# EAGLE design Goethe_RFID_v2 (EAGLE 7.7.0)
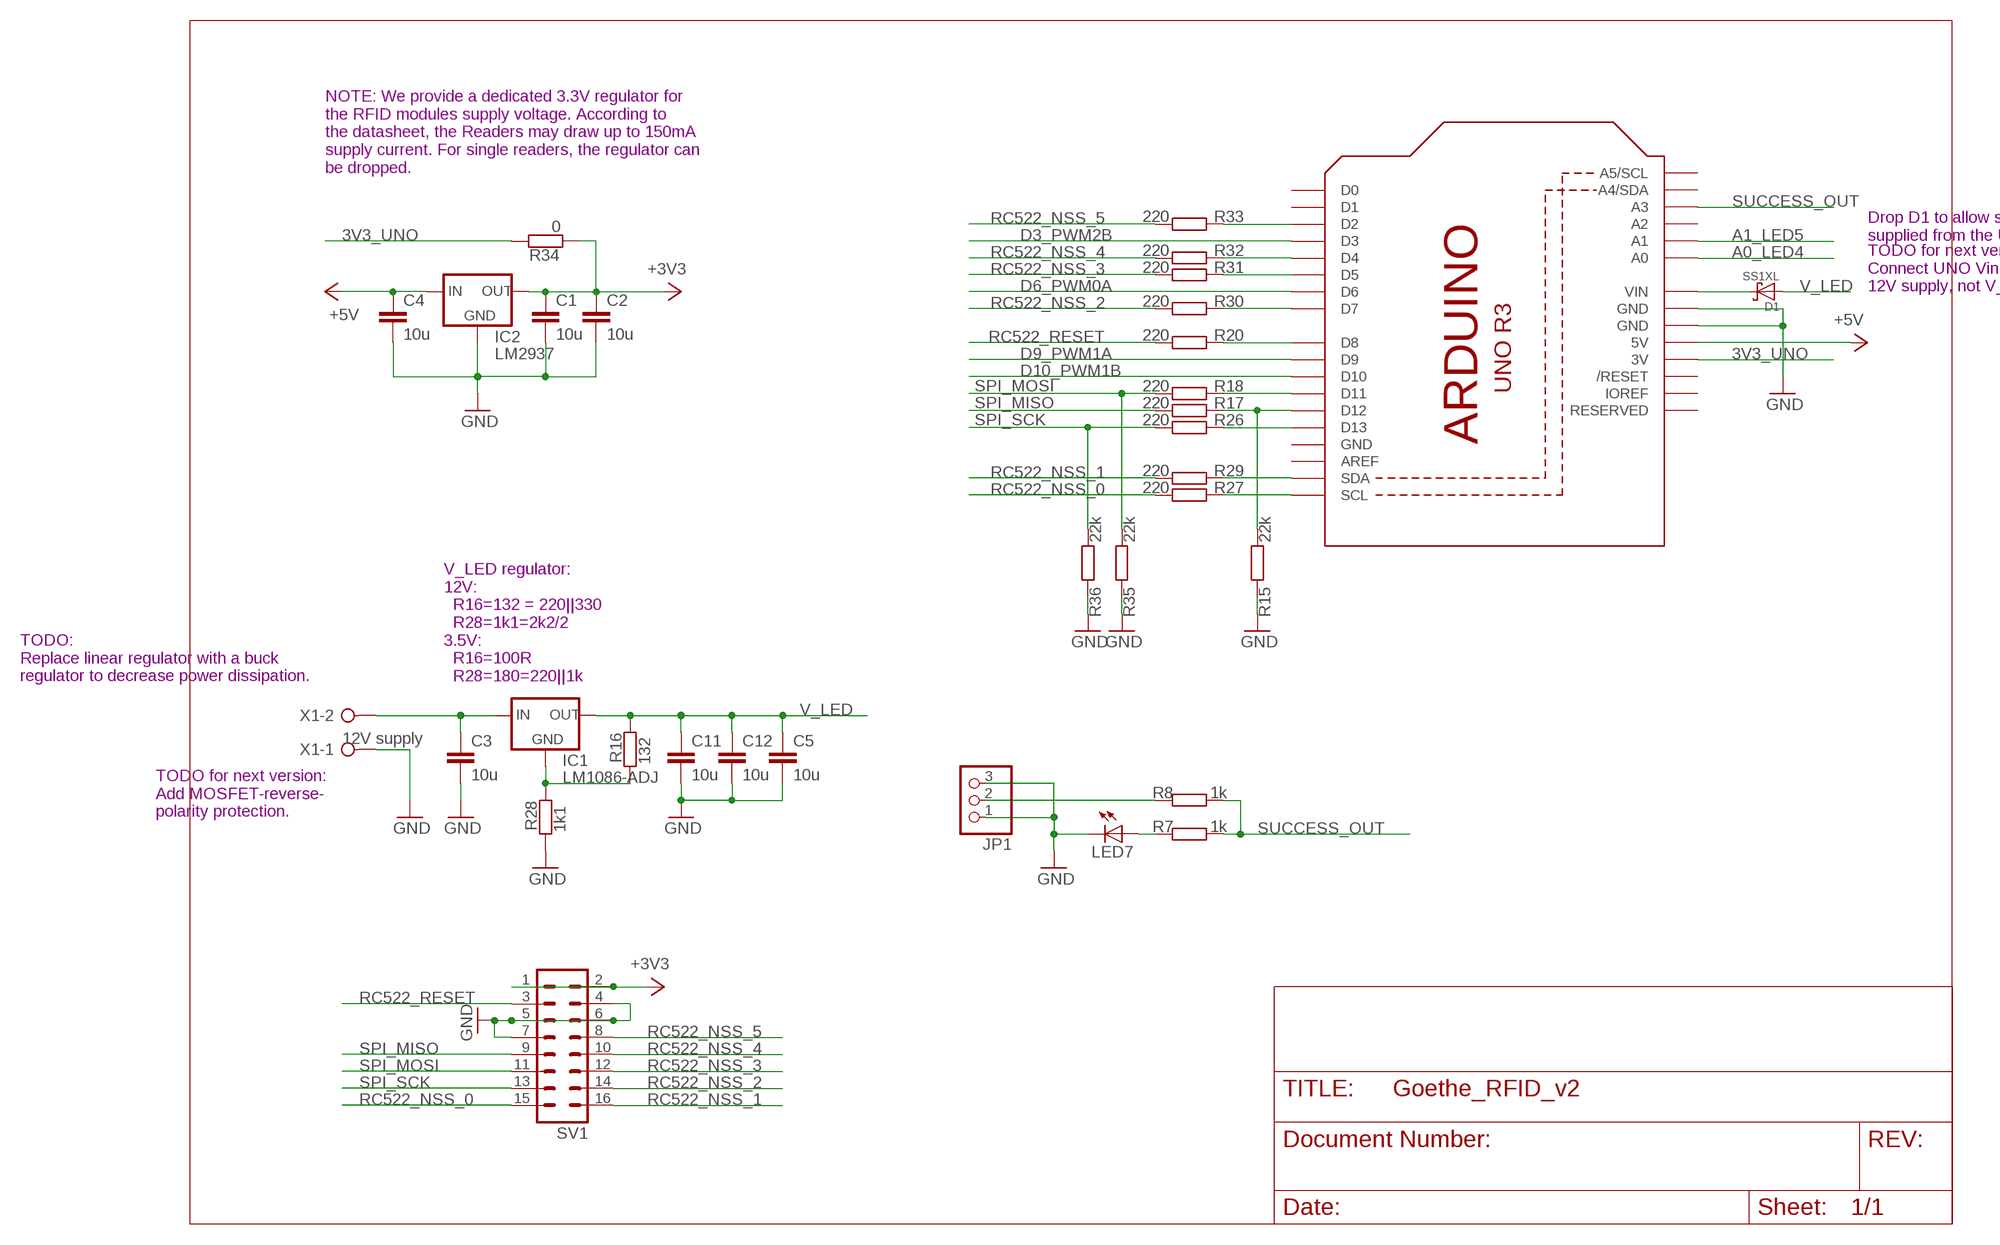
[diagram p0: schematic, sheet 1, part 1 of 2]
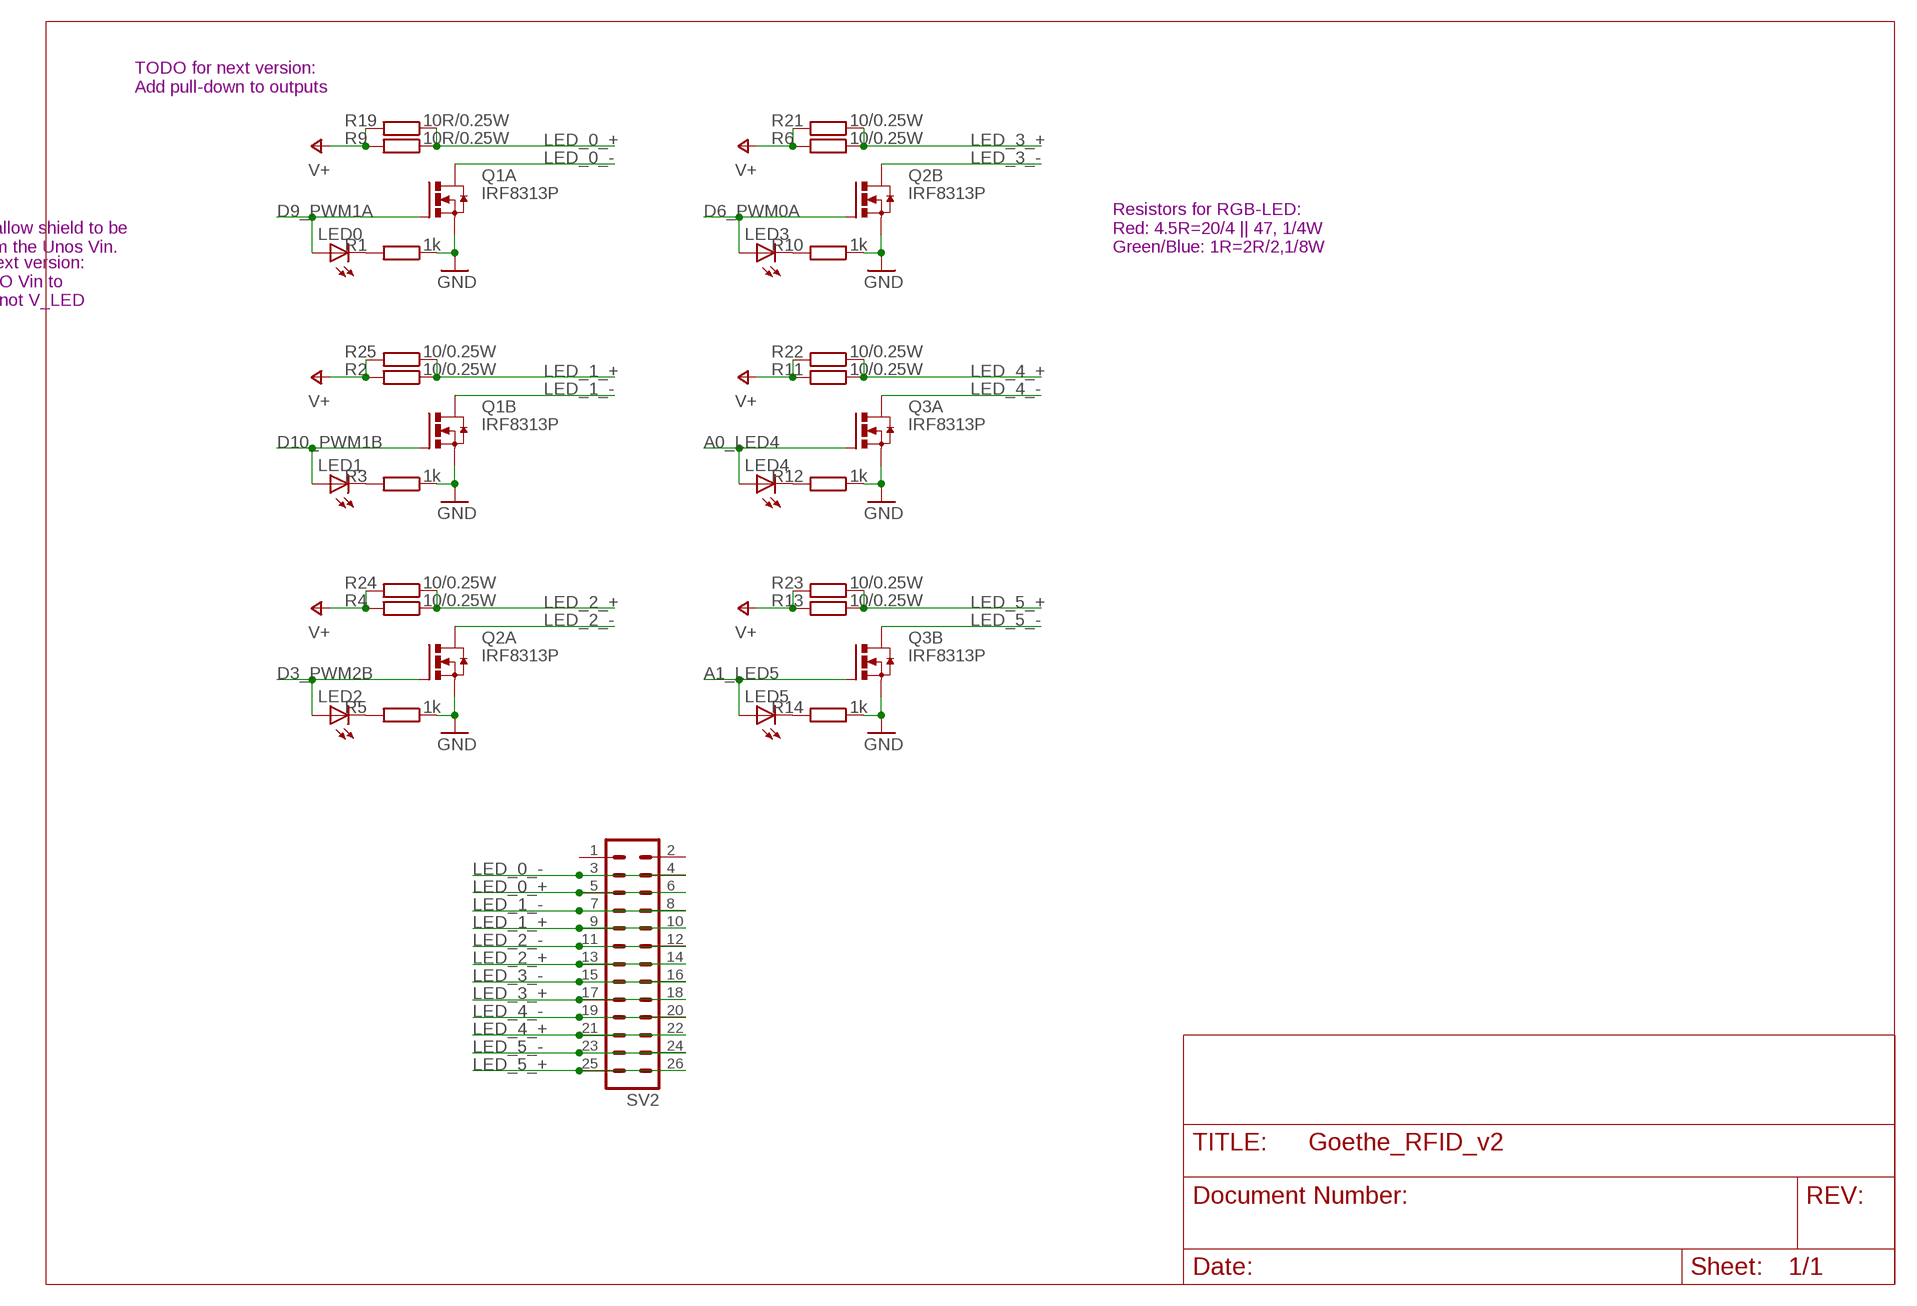
[diagram p1: schematic, sheet 1, part 2 of 2]

## Parts
C1  10u  C-EUC1206  [C1206]
C2  10u  C-EUC1206  [C1206]
C3  10u  C-EUC1206  [C1206]
C4  10u  C-EUC1206  [C1206]
C5  10u  C-EUC1206  [C1206]
C11  10u  C-EUC1206  [C1206]
C12  10u  C-EUC1206  [C1206]
D1  SS1XL  [SUB_SMA]
IC1  LM1086-ADJ  VREG_TO220L_A  [TO220L1]
IC2  LM2937  VREG_SOT223  [SOT223]
JP1  PINHD-1X3/90  [1X03/90]
LED0  LED3MM  [LED3MM]
LED1  LED3MM  [LED3MM]
LED2  LED3MM  [LED3MM]
LED3  LED3MM  [LED3MM]
LED4  LED3MM  [LED3MM]
LED5  LED3MM  [LED3MM]
LED7  LED3MM  [LED3MM]
M1  ARDUINO_R3_SMALL  [ARDUINOR3_SMALL]
Q1  IRF8313P  [SO-08]
Q2  IRF8313P  [SO-08]
Q3  IRF8313P  [SO-08]
R1  1k  R-EU_R0805  [R0805]
R2  10/0.25W  R-EU_R0805  [R0805]
R3  1k  R-EU_R0805  [R0805]
R4  10/0.25W  R-EU_R0805  [R0805]
R5  1k  R-EU_R0805  [R0805]
R6  10/0.25W  R-EU_R0805  [R0805]
R7  1k  R-EU_R0805  [R0805]
R8  1k  R-EU_R0805  [R0805]
R9  10R/0.25W  R-EU_R0805  [R0805]
R10  1k  R-EU_R0805  [R0805]
R11  10/0.25W  R-EU_R0805  [R0805]
R12  1k  R-EU_R0805  [R0805]
R13  10/0.25W  R-EU_R0805  [R0805]
R14  1k  R-EU_R0805  [R0805]
R15  22k  R-EU_R0805  [R0805]
R16  132  R-EU_R0805  [R0805]
R17  220  R-EU_R0805  [R0805]
R18  220  R-EU_R0805  [R0805]
R19  10R/0.25W  R-EU_R0805  [R0805]
R20  220  R-EU_R0805  [R0805]
R21  10/0.25W  R-EU_R0805  [R0805]
R22  10/0.25W  R-EU_R0805  [R0805]
R23  10/0.25W  R-EU_R0805  [R0805]
R24  10/0.25W  R-EU_R0805  [R0805]
R25  10/0.25W  R-EU_R0805  [R0805]
R26  220  R-EU_R0805  [R0805]
R27  220  R-EU_R0805  [R0805]
R28  1k1  R-EU_R0805  [R0805]
R29  220  R-EU_R0805  [R0805]
R30  220  R-EU_R0805  [R0805]
R31  220  R-EU_R0805  [R0805]
R32  220  R-EU_R0805  [R0805]
R33  220  R-EU_R0805  [R0805]
R34  0  R-EU_R0805  [R0805]
R35  22k  R-EU_R0805  [R0805]
R36  22k  R-EU_R0805  [R0805]
SV1  ML16  [ML16]
SV2  ML26  [ML26]
X1  12V supply  W237-02P  [W237-132]

## Nets
3V3_UNO: M1.3V R34.1
+3V3: C1.1 C2.1 IC2.3(OUT) R34.2 SV1.1 SV1.2
+5V: C4.1 IC2.1(IN) M1.5V
A0_LED4: LED4.A M1.A0 Q3.4(A:G)
A1_LED5: LED5.A M1.A1 Q3.2(B:G)
D3_PWM2B: LED2.A M1.D3 Q2.4(A:G)
D6_PWM0A: LED3.A M1.D6 Q2.2(B:G)
D9_PWM1A: LED0.A M1.D9 Q1.4(A:G)
D10_PWM1B: LED1.A M1.D10 Q1.2(B:G)
GND: C1.2 C2.2 C3.2 C4.2 C5.2 C11.2 C12.2 IC2.2(GND) JP1.1 JP1.3 LED7.K(C) M1.GND@1(GND) M1.GND@2(GND) Q1.1(B:S) Q1.3(A:S) Q2.1(B:S) Q2.3(A:S) Q3.1(B:S) Q3.3(A:S) R1.1 R3.1 R5.1 R10.1 R12.1 R14.1 R15.2 R28.2 R35.2 R36.2 SV1.4 SV1.5 SV1.6 SV1.7 X1.1
LED_0_+: R9.1 R19.1 SV2.5 SV2.6
LED_0_-: Q1.5(A:D) Q1.6(A:D) SV2.3 SV2.4
LED_1_+: R2.1 R25.1 SV2.9 SV2.10
LED_1_-: Q1.7(B:D) Q1.8(B:D) SV2.7 SV2.8
LED_2_+: R4.1 R24.1 SV2.13 SV2.14
LED_2_-: Q2.5(A:D) Q2.6(A:D) SV2.11 SV2.12
LED_3_+: R6.1 R21.1 SV2.17 SV2.18
LED_3_-: Q2.7(B:D) Q2.8(B:D) SV2.15 SV2.16
LED_4_+: R11.1 R22.1 SV2.21 SV2.22
LED_4_-: Q3.5(A:D) Q3.6(A:D) SV2.19 SV2.20
LED_5_+: R13.1 R23.1 SV2.25 SV2.26
LED_5_-: Q3.7(B:D) Q3.8(B:D) SV2.23 SV2.24
N$1: LED1.K(C) R3.2
N$2: M1.D12 R15.1 R17.2
N$3: LED2.K(C) R5.2
N$4: LED3.K(C) R10.2
N$5: LED4.K(C) R12.2
N$6: LED5.K(C) R14.2
N$7: M1.D13 R26.2
N$8: LED7.A R7.2
N$9: C3.1 IC1.3(IN) X1.2
N$10: LED0.K(C) R1.2
N$11: IC1.1(GND) R16.2 R28.1
N$12: M1.D11 R18.2
N$13: M1.D8 R20.2
N$14: M1.SCL R27.2
N$15: M1.SDA R29.2
N$16: M1.D2 R33.2
N$17: M1.D4 R32.2
N$18: M1.D5 R31.2
N$19: M1.D7 R30.2
N$20: D1.C M1.VIN
RC522_NSS_0: R27.1 SV1.15
RC522_NSS_1: R29.1 SV1.16
RC522_NSS_2: R30.1 SV1.14
RC522_NSS_3: R31.1 SV1.12
RC522_NSS_4: R32.1 SV1.10
RC522_NSS_5: R33.1 SV1.8
RC522_RESET: R20.1 SV1.3
SPI_MISO: R17.1 SV1.9
SPI_MOSI: R18.1 R35.1 SV1.11
SPI_SCK: R26.1 R36.1 SV1.13
SUCCESS_OUT: M1.A3 R7.1 R8.1
SUCCESS_OUT_: JP1.2 R8.2
V_LED: C5.1 C11.1 C12.1 D1.A IC1.2(OUT) R2.2 R4.2 R6.2 R9.2 R11.2 R13.2 R16.1 R19.2 R21.2 R22.2 R23.2 R24.2 R25.2 ; supply symbol labelled V+
Unconnected: M1.A2 M1.A4(A4/SDA) M1.A5(A5/SCL) M1.AREF M1.D0 M1.D1 M1.IOREF M1.RESERVED M1.RESET(/RESET) SV2.1 SV2.2

## Notes on the sheet
- TODO for next version:
  Add pull-down to outputs
- NOTE: We provide a dedicated 3.3V regulator for
  the RFID modules supply voltage. According to
  the datasheet, the Readers may draw up to 150mA
  supply current. For single readers, the regulator can
  be dropped.
- Drop D1 to allow shield to be 
  supplied from the Unos Vin.
- Resistors for RGB-LED:
  Red: 4.5R=20/4 || 47, 1/4W
  Green/Blue: 1R=2R/2,1/8W
- TODO for next version:
  Connect UNO Vin to
  12V supply, not V_LED
- TODO:
  Replace linear regulator with a buck 
  regulator to decrease power dissipation.
- V_LED regulator:
  12V:
    R16=132 = 220||330
    R28=1k1=2k2/2
  3.5V:
    R16=100R
    R28=180=220||1k
- TODO for next version:
  Add MOSFET-reverse-
  polarity protection.

## Power pins joined to a net without a drawn wire
GND: M1.GND

## Library data of the parts
C1-C5 C11 C12 = rcl:C-EU: CAPACITOR, European symbol
D1 = sm_ilec_semi:SS1XL
IC1 IC2 = sm_ilec_supply:VREG: Positiv Voltage Regulator
JP1 = pinhead:PINHD-1X3: PIN HEADER
LED0 LED1-LED5 LED7 = led:LED: LED OSRAM: - CHIPLED LG R971, LG N971, LY N971, LG Q971, LY Q971, LO R971, LY R971 LH N974, LH R974 LS Q976, LO Q976, LY Q976 LO Q996 - Hyper CHIPLED LW Q18S LB Q993, LB Q99A, LB R99A - SideLED LS A670, LO A670, LY A670, LG A670, LP A670 LB A673, LV A673, LT A673, LW A673 LH A674 LY A675 LS A676, LA A676, LO A676, LY A676, LW A676 LS A679, LY A679, LG A679 - Hyper Micro SIDELED® LS Y876, LA Y876, LO Y876, LY Y876 LT Y87S - SmartLED LW L88C, LW L88S LB L89C, LB L89S, LG L890 LS L89K, LO L89K, LY L89K LS L896, LA L896, LO L896, LY L896 - TOPLED LS T670, LO T670, LY T670, LG T670, LP T670 LSG T670, LSP T670, LSY T670, LOP T670, LYG T670 LG T671, LOG T671, LSG T671 LB T673, LV T673, LT T673, LW T673 LH T674 LS T676, LA T676, LO T676, LY T676, LB T676, LH T676, LSB T676, LW T676 LB T67C, LV T67C, LT T67C, LS T67K, LO T67K, LY T67K, LW E67C LS E67B, LA E67B, LO E67B, LY E67B, LB E67C, LV E67C, LT E67C LW T67C LS T679, LY T679, LG T679 LS T770, LO T770, LY T770, LG T770, LP T770 LB T773, LV T773, LT T773, LW T773 LH T774 LS E675, LA E675, LY E675, LS T675 LS T776, LA T776, LO T776, LY T776, LB T776 LHGB T686 LT T68C, LB T68C - Hyper Mini TOPLED® LB M676 - Mini TOPLED Santana® LG M470 LS M47K, LO M47K, LY M47K Source: http://www.osram.convergy.de LUXEON: - LUMILED® LXK2-PW12-R00, LXK2-PW12-S00, LXK2-PW14-U00, LXK2-PW14-V00 LXK2-PM12-R00, LXK2-PM12-S00, LXK2-PM14-U00 LXK2-PE12-Q00, LXK2-PE12-R00, LXK2-PE12-S00, LXK2-PE14-T00, LXK2-PE14-U00 LXK2-PB12-K00, LXK2-PB12-L00, LXK2-PB12-M00, LXK2-PB14-N00, LXK2-PB14-P00, LXK2-PB14-Q00 LXK2-PR12-L00, LXK2-PR12-M00, LXK2-PR14-Q00, LXK2-PR14-R00 LXK2-PD12-Q00, LXK2-PD12-R00, LXK2-PD12-S00 LXK2-PH12-R00, LXK2-PH12-S00 LXK2-PL12-P00, LXK2-PL12-Q00, LXK2-PL12-R00 Source: www.luxeon.com KINGBRIGHT: KA-3528ASYC Source: www.kingbright.com
M1 = 00_sm_arduino:ARDUINO_R3
Q1-Q3 = transistor-power:IRF8313P: HEXFET(R) Power MOSFET Source: Data sheet <http://www.irf.com/product-info/datasheets/data/irf8313pbf.pdf>
R1-R36 = rcl:R-EU_: RESISTOR, European symbol
SV1 = con-harting-ml:ML16: HARTING; OC_FARNELL: unknown; OC_NEWARK: unknown
SV2 = con-harting-ml:ML26: HARTING; OC_FARNELL: unknown; OC_NEWARK: unknown
X1 = con-wago-508:W237-02P: WAGO SREW CLAMP; OC_FARNELL: unknown; OC_NEWARK: unknown

## Board
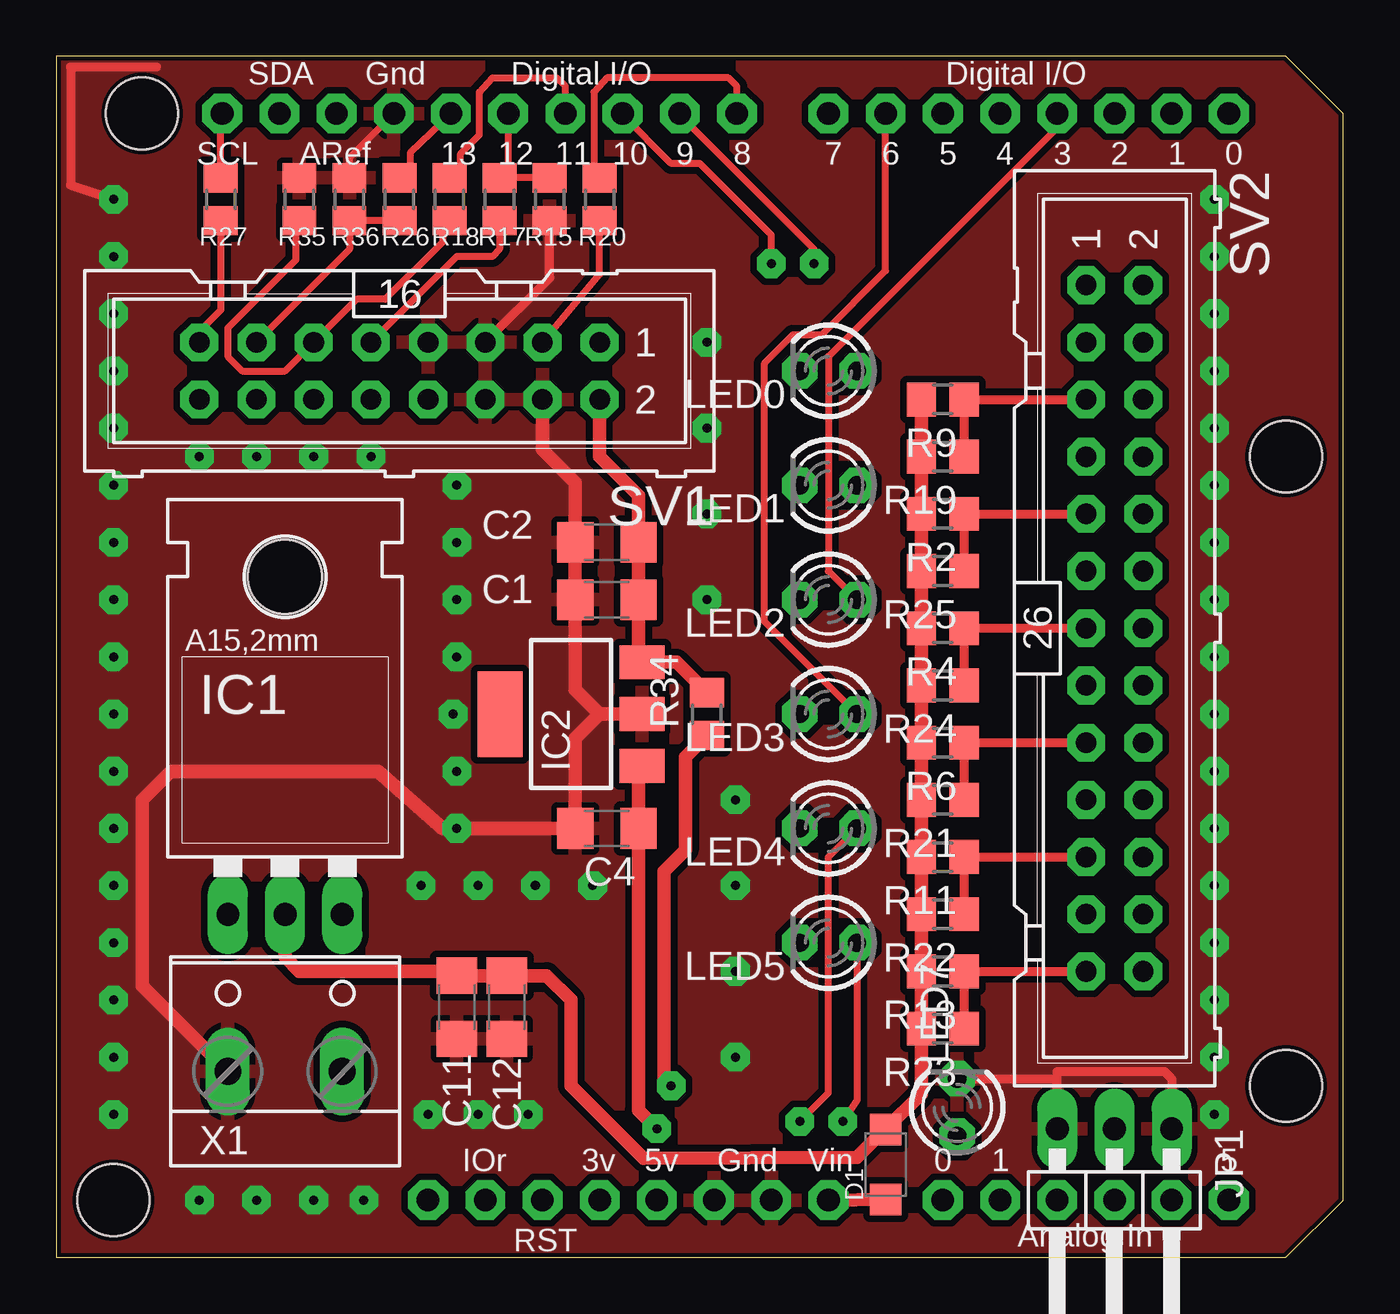
[diagram p2: board, top side]
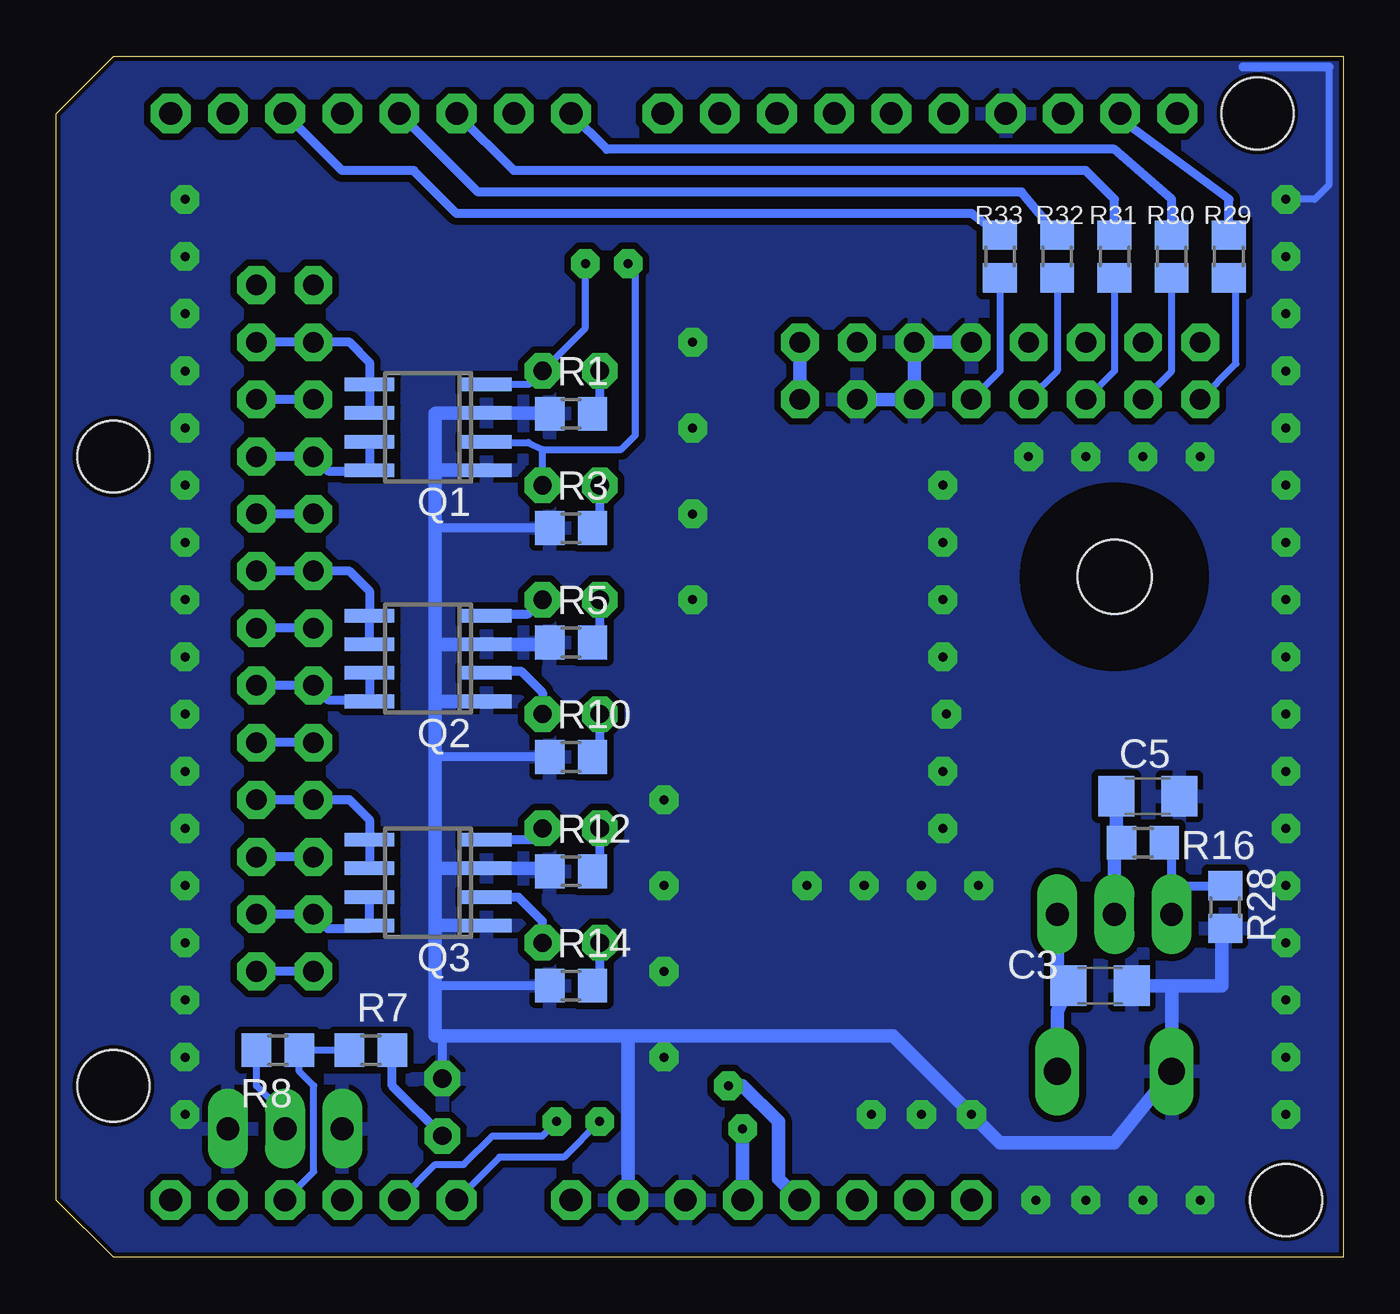
[diagram p3: board, bottom side, seen from below]

Size 57.15 x 53.34 mm. Coordinates in mm from the lower left corner, seen from the top.
Copper layers (1*16): Top 0.035mm / dielectric 1.5mm / Bottom 0.035mm
Design rules "default *": minimum track width 10mil, minimum drill 0.010159375mm, track to track 0.3mm, track to pad 0.3mm, pad to pad 0.3mm, via to via 0.3mm, smd to smd 0mil, copper to edge 0.2mm, drill to drill 0.2mm, minimum pad ring 15mil, minimum via ring 8mil, stop-mask expansion 4mil, vias tented up to drill 0mil, thermal gap 10mil

### Footprints (pad centres in the part's own frame; a part is rotated, then mirrored left to right if it is on the bottom)
C1206 = smd 1.6 x 1.8: 1 -1.4,0; 2 1.4,0
SUB_SMA = smd 1.4 x 1.4: A 1.55,0; C -1.55,0
TO220L1 = drill 1.016 long: 1 -2.54,-3.81; 2 0,-3.81; 3 2.54,-3.81 | hole 3.302: 0,11.176
SOT223 = smd 1.5 x 2: 1 -2.3,-3.15; 2 0,-3.15; 3 2.3,-3.15 | smd 3.8 x 2: 4 0,3.15
1X03/90 = drill 1.016 long: 1 -2.54,-3.81; 2 0,-3.81; 3 2.54,-3.81
LED3MM = drill 0.813 octagon: A -1.27,0; K 1.27,0
ARDUINOR3_SMALL = drill 1 pad 1.676 octagon: 3V 24.13,2.54; 5V 26.67,2.54; A0 39.37,2.54; A1 41.91,2.54; A2 44.45,2.54; A3 46.99,2.54; A4 49.53,2.54; A5 52.07,2.54; AREF 12.446,50.8; D0 52.07,50.8; D1 49.53,50.8; D2 46.99,50.8; D3 44.45,50.8; D4 41.91,50.8; D5 39.37,50.8; D6 36.83,50.8; D7 34.29,50.8; D8 30.226,50.8; D9 27.686,50.8; D10 25.146,50.8; D11 22.606,50.8; D12 20.066,50.8; D13 17.526,50.8; GND 14.986,50.8; GND@1 31.75,2.54; GND@2 29.21,2.54; IOREF 19.05,2.54; RESERVED 16.51,2.54; RESET 21.59,2.54; SCL 7.366,50.8; SDA 9.906,50.8; VIN 34.29,2.54 | hole 3.2: 3.81,50.8; 2.54,2.54; 54.61,35.56; 54.61,7.62
SO-08 = smd 0.6 x 2.2: 1 -1.905,-2.6; 2 -0.635,-2.6; 3 0.635,-2.6; 4 1.905,-2.6; 5 1.905,2.6; 6 0.635,2.6; 7 -0.635,2.6; 8 -1.905,2.6
R0805 = smd 1.3 x 1.5: 1 -0.95,0; 2 0.95,0
ML16 = drill 0.914 octagon: 1 -8.89,-1.27; 2 -8.89,1.27; 3 -6.35,-1.27; 4 -6.35,1.27; 5 -3.81,-1.27; 6 -3.81,1.27; 7 -1.27,-1.27; 8 -1.27,1.27; 9 1.27,-1.27; 10 1.27,1.27; 11 3.81,-1.27; 12 3.81,1.27; 13 6.35,-1.27; 14 6.35,1.27; 15 8.89,-1.27; 16 8.89,1.27
ML26 = drill 0.914 octagon: 1 -15.24,-1.27; 2 -15.24,1.27; 3 -12.7,-1.27; 4 -12.7,1.27; 5 -10.16,-1.27; 6 -10.16,1.27; 7 -7.62,-1.27; 8 -7.62,1.27; 9 -5.08,-1.27; 10 -5.08,1.27; 11 -2.54,-1.27; 12 -2.54,1.27; 13 0,-1.27; 14 0,1.27; 15 2.54,-1.27; 16 2.54,1.27; 17 5.08,-1.27; 18 5.08,1.27; 19 7.62,-1.27; 20 7.62,1.27; 21 10.16,-1.27; 22 10.16,1.27; 23 12.7,-1.27; 24 12.7,1.27; 25 15.24,-1.27; 26 15.24,1.27
W237-132 = drill 1.194 long: 1 -2.54,-0.635; 2 2.54,-0.635

### Placement (x,y rotation side)
C1  24.45,29.21 180 top
C2  24.45,31.75 180 top
C3  10.79,12.06 0 bottom
C4  24.45,19.05 180 top
C5  8.68,20.48 0 bottom
C11  17.78,11.11 270 top
C12  20,11.11 270 top
D1  36.83,4.13 90 top
IC1  10.16,19.05 0 top
IC2  22.86,24.13 90 top
JP1  46.99,1.91 180 top
LED0  34.29,39.37 180 top
LED1  34.29,34.29 180 top
LED2  34.29,29.21 180 top
LED3  34.29,24.13 180 top
LED4  34.29,19.05 180 top
LED5  34.29,13.97 180 top
LED7  40.01,6.67 90 top
M1  0,0 0 top
Q1  40.64,36.86 90 bottom
Q2  40.64,26.59 90 bottom
Q3  40.64,16.64 90 bottom
R1  34.29,37.47 0 bottom
R2  39.37,33.02 180 top
R3  34.29,32.38 0 bottom
R4  39.37,27.94 180 top
R5  34.29,27.3 0 bottom
R6  39.37,22.86 180 top
R7  43.18,9.21 0 bottom
R8  47.31,9.21 180 bottom
R9  39.37,38.1 180 top
R10  34.29,22.23 0 bottom
R11  39.37,17.78 180 top
R12  34.29,17.14 0 bottom
R13  39.37,12.7 180 top
R14  34.29,12.06 0 bottom
R15  21.91,46.99 270 top
R16  8.89,18.41 0 bottom
R17  19.68,46.99 90 top
R18  17.46,46.99 90 top
R19  39.37,35.56 180 top
R20  24.13,46.99 90 top
R21  39.37,20.32 180 top
R22  39.37,15.24 180 top
R23  39.37,10.16 180 top
R24  39.37,25.4 180 top
R25  39.37,30.48 180 top
R26  15.24,46.99 90 top
R27  7.3,46.99 90 top
R28  5.24,15.56 270 bottom
R29  5.08,44.45 90 bottom
R30  7.62,44.45 90 bottom
R31  10.16,44.45 90 bottom
R32  12.7,44.45 90 bottom
R33  15.24,44.45 90 bottom
R34  28.89,24.13 90 top
R35  10.79,46.99 90 top
R36  13.02,46.99 90 top
SV1  15.24,39.37 180 top
SV2  47,27.94 270 top
X1  10.16,8.89 0 top

### Tracks (layer width: path | path; a pad name or v marks a point on that pad's centre or on a via)
3V3_UNO  (via drill 0.4 pad 1.27)
  Top 0.61: R34.1 27.94,22.23 27.94,18.1 26.99,17.14 26.99,7.94 v27.3,7.62
  Bottom 0.61: v27.3,7.62 26.67,7.62 25.08,6.03 25.08,3.49 M1.3V
+3V3
  Top 0.61: SV1.2 24.13,35.56 25.85,33.84 C2.1 C1.1 25.85,26.59 IC2.3 27.54,26.43 R34.2
  Bottom 0.61: SV1.2 SV1.1
+5V  (via drill 0.4 pad 1.27)
  Top 0.61: IC2.1 25.85,21.67 C4.1 25.85,6.54 v26.67,5.71
  Bottom 0.61: M1.5V v26.67,5.71
A0_LED4  (via drill 0.4 pad 1.27)
  Top 0.305: v33.02,6.03 34.29,7.3 34.29,17.78 LED4.A
  Bottom 0.305: v33.02,6.03 34.61,4.45 37.47,4.45 M1.A0
  Bottom 0.406: LED4.A 36.06,18.55 Q3.4
A1_LED5  (via drill 0.4 pad 1.27)
  Top 0.305: LED5.A 35.56,6.99 v34.92,6.03
  Bottom 0.305: M1.A1 40.32,4.13 39.05,4.13 37.78,5.4 35.56,5.4 v34.92,6.03
  Bottom 0.406: LED5.A 35.56,14.92 36.64,16 Q3.2
D3_PWM2B
  Top 0.305: LED2.A 34.29,30.48 34.29,40.01 44.45,50.16 M1.D3
  Bottom 0.406: LED2.A 36.2,28.57 37.96,28.57 Q2.4
D6_PWM0A
  Top 0.305: LED3.A 31.43,28.26 31.43,39.69 32.7,40.96 33.97,40.96 36.83,43.81 M1.D6
  Bottom 0.406: LED3.A 35.56,25.08 36.51,26.04 37.96,26.04 Q2.2
D9_PWM1A  (via drill 0.4 pad 1.27)
  Top 0.305: M1.D9 28.32,50.1 33.66,44.77 v33.66,44.13
  Bottom 0.305: Q1.4 36.16,38.77 LED0.A 33.66,41.27 v33.66,44.13
D10_PWM1B  (via drill 0.4 pad 1.27)
  Top 0.305: v31.75,44.13 31.75,45.4 28.57,48.58 27.3,48.58 25.15,50.74 M1.D10
  Bottom 0.305: LED1.A 35.56,35.88 | 35.56,35.88 36.2,36.2 38.01,36.2 | 35.56,35.88 32.07,35.88 31.43,36.51 31.43,43.81 v31.75,44.13
  Bottom 0.406: Q1.2 38.01,36.2
GND  (via drill 0.4 pad 1.27)
  Top 0.305: R36.2 13.02,48.83 M1.GND
  Top 0.406: LED7.K 44.45,7.94 | 44.45,7.94 44.45,8.26 49.21,8.26 49.53,7.94 JP1.1 | JP1.3 44.45,7.94 | SV1.5 21.91,43.5 R15.2 | 4.45,52.86 0.64,52.86 0.64,47.62 v2.54,46.99
  Top 0.61: SV1.4 21.59,35.88 23.05,34.42 C2.2 C1.2 23.05,25.21 24.13,24.13 | 24.13,24.13 23.05,23.05 C4.2 17.14,19.05 14.29,21.59 5.08,21.59 3.81,20.32 3.81,12.06 X1.1 | IC2.2 24.13,24.13
  Bottom 0.305: 0.64,52.86 0.64,47.62 1.27,46.99 v2.54,46.99
  Bottom 0.406: R3.1 40.32,32.38 | R10.1 40.01,22.23 40.32,22.54 | R14.1 40.32,12.06 | LED7.K 40.01,9.84 39.37,9.84 | 0.64,52.86 4.45,52.86
  Bottom 0.61: SV1.7 SV1.5 SV1.6 SV1.4 | 40.32,24.77 40.32,22.54 40.32,17.14 | 40.32,24.77 40.32,27.3 | 40.32,27.3 40.32,32.38 40.32,34.92 | 40.32,34.92 40.32,37.47 40.29,37.5 Q1.3 35.27,37.5 R1.1 | 40.32,14.61 40.32,12.06 40.32,9.84 39.37,9.84 31.75,9.84 | 40.32,14.61 40.32,17.14 | 7.62,12.06 X1.1 10.16,5.08 15.24,5.08 20,9.84 31.75,9.84 | 7.62,12.06 C3.2 | R28.2 5.4,14.05 5.4,12.06 7.62,12.06 | M1.GND@1 31.75,9.84 | Q1.1 40.29,34.96 40.32,34.92 | R5.1 35.32,27.23 Q2.3 40.24,27.23 40.32,27.3 | Q2.1 40.24,24.69 40.32,24.77 | R12.1 35.37,17.27 Q3.3 40.19,17.27 40.32,17.14 | Q3.1 40.19,14.73 40.32,14.61
  other vias: 20.95,6.35 18.73,6.35 16.51,6.35 13.65,2.54 11.43,2.54 8.89,2.54 6.35,2.54 2.54,6.35 2.54,8.89 2.54,11.43 2.54,13.97 2.54,16.51 2.54,19.05 2.54,21.59 2.54,24.13 2.54,26.67 2.54,29.21 2.54,31.75 2.54,34.29 2.54,44.45 2.54,41.91 2.54,39.37 2.54,36.83 23.81,16.51 21.27,16.51 18.73,16.51 16.19,16.51 51.44,46.99 51.44,44.45 51.44,41.91 51.44,39.37 51.44,36.83 51.44,34.29 51.44,31.75 51.44,29.21 51.44,26.67 51.44,24.13 51.44,21.59 51.44,19.05 51.44,16.51 51.44,13.97 51.44,11.43 51.44,8.89 51.44,6.35 6.35,35.56 8.89,35.56 11.43,35.56 13.97,35.56 17.78,34.29 17.78,31.75 17.78,29.21 17.78,26.67 17.62,24.13 17.78,21.59 17.78,19.05 30.16,8.89 30.16,12.7 30.16,16.51 30.16,20.32 28.89,29.21 28.89,33.02 28.89,36.83 28.89,40.64
  pour Top: 0,0 54.61,0 57.15,2.54 57.15,50.8 54.61,53.34 0,53.34
  pour Bottom: 0,53.34 54.61,53.34 57.15,50.8 57.15,2.54 54.61,0 0,0
LED_0_+
  Top 0.406: R19.1 R9.1 SV2.5
  Bottom 0.406: SV2.5 SV2.6
LED_0_-
  Bottom 0.406: Q1.6 Q1.5 43.24,39.75 44.13,40.64 SV2.3 SV2.4
LED_1_+
  Top 0.406: R25.1 R2.1 SV2.9
  Bottom 0.406: SV2.9 SV2.10
LED_1_-
  Bottom 0.406: Q1.7 Q1.8 43.24,34.92 45.09,34.92 SV2.7 SV2.8
LED_2_+
  Top 0.406: R24.1 R4.1 SV2.13
  Bottom 0.406: SV2.13 SV2.14
LED_2_-
  Bottom 0.406: Q2.6 Q2.5 43.24,29.59 44.13,30.48 SV2.11 SV2.12
LED_3_+
  Top 0.406: R21.1 R6.1 SV2.17
  Bottom 0.406: SV2.17 SV2.18
LED_3_-
  Bottom 0.406: Q2.7 Q2.8 43.24,24.77 45.09,24.77 SV2.15 SV2.16
LED_4_+
  Top 0.406: R22.1 R11.1 SV2.21
  Bottom 0.406: SV2.21 SV2.22
LED_4_-
  Bottom 0.406: Q3.6 Q3.5 43.24,19.43 44.13,20.32 SV2.19 SV2.20
LED_5_+
  Top 0.406: R23.1 R13.1 SV2.25
  Bottom 0.406: SV2.25 SV2.26
LED_5_-
  Bottom 0.406: Q3.7 Q3.8 43.24,14.61 45.09,14.61 SV2.23 SV2.24
N$1
  Bottom 0.406: LED1.K 33.02,32.7 R3.2
N$2
  Top 0.305: R15.1 R17.2 20.07,48.32 M1.D12
N$3
  Bottom 0.406: LED2.K 33.02,27.62 R5.2
N$4
  Bottom 0.406: LED3.K 33.02,22.55 R10.2
N$5
  Bottom 0.406: LED4.K 33.02,17.46 R12.2
N$6
  Bottom 0.406: LED5.K 33.02,12.38 R14.2
N$7
  Top 0.305: M1.D13 15.72,49.05 15.72,48.26 R26.2
N$8
  Bottom 0.406: LED7.A 42.23,7.62 R7.2
N$9
  Bottom 0.61: X1.2 12.7,10.93 C3.1 12.7,11.94 IC1.3
N$10
  Bottom 0.406: LED0.K 33.02,37.78 R1.2
N$11
  Bottom 0.406: IC1.1 7.62,16.19 7.63,16.45 | 7.63,16.45 7.14,16.51 R28.1 | R16.2 7.63,18.11 7.63,16.45
N$12
  Top 0.305: M1.D11 22.61,52.01 22.23,52.39 19.37,52.39 18.8,51.75 18.8,49.85 17.94,48.99 17.94,48.42 R18.2
N$13
  Top 0.305: R20.2 23.88,48.26 23.88,51.75 24.45,52.39 29.84,52.39 30.23,52.01 M1.D8
N$14
  Top 0.305: R27.2 7.3,50.26 M1.SCL
N$15
  Bottom 0.406: R29.2 5.08,46.99 9.91,50.55 M1.SDA
N$16
  Bottom 0.406: R33.2 16.51,46.35 39.37,46.35 41.27,48.26 44.45,48.26 M1.D2
N$17
  Bottom 0.406: R32.2 14.29,47.31 38.42,47.31 M1.D4
N$18
  Bottom 0.406: R31.2 10.16,46.99 11.43,48.26 36.83,48.26 M1.D5
N$19
  Bottom 0.406: R30.2 7.62,46.99 10.16,49.21 32.7,49.21 M1.D7
N$20
  Top 0.61: M1.VIN D1.C
RC522_NSS_0
  Top 0.305: R27.1 7.3,42.07 6.35,41.12 SV1.15
RC522_NSS_1
  Bottom 0.305: SV1.16 4.76,39.69 4.76,43.18 R29.1
  Bottom 0.406: R29.1
RC522_NSS_2
  Bottom 0.305: SV1.14 7.62,39.37 R30.1
RC522_NSS_3
  Bottom 0.305: R31.1 10.16,39.37 SV1.12
RC522_NSS_4
  Bottom 0.305: R32.1 12.7,39.37 SV1.10
RC522_NSS_5
  Bottom 0.305: R33.1 15.24,39.37 SV1.8
RC522_RESET
  Top 0.305: SV1.3 24.13,43.66 R20.1
SPI_MISO
  Top 0.305: R17.1 19.68,44.77 19.37,44.45 17.78,44.45 SV1.9
SPI_MOSI
  Top 0.305: 17.14,45.72 17.14,45.09 14.61,42.55 13.34,42.55 SV1.11 10.16,39.37 8.26,39.37 7.62,40.01 7.62,41.27 10.64,44.29 10.64,45.88 R35.1
  Top 0.406: R18.1 17.14,45.72
SPI_SCK
  Top 0.305: 11.75,43.5 SV1.13 13.02,44.77 R36.1 R26.1
SUCCESS_OUT
  Bottom 0.305: M1.A3 45.72,3.81 45.72,7.62 46.35,8.26 46.35,8.89 | R8.1 R7.1
  Bottom 0.406: 46.35,8.89 R8.1
SUCCESS_OUT_
  Bottom 0.305: JP1.2 46.99,6.35 48.26,7.62 R8.2
V_LED
  Top 0.61: R9.2 R19.2 R2.2 R25.2 R4.2 R24.2 R6.2 R21.2 R11.2 R22.2 R13.2 R23.2 38.42,7.26 D1.A 36.79,5.68 35.56,4.45 26.07,4.41 22.86,7.62 22.86,11.43 21.78,12.51 C12.1 C11.1 17.65,12.7 10.79,12.7 10.16,13.34 IC1.2
  Bottom 0.61: IC1.2 10.16,17.78 | 10.16,17.78 R16.1 | 10.16,17.78 10.08,17.86 C5.1